# EasyEDA schematic 原理图_转接板1_含压缩推杆控制.json
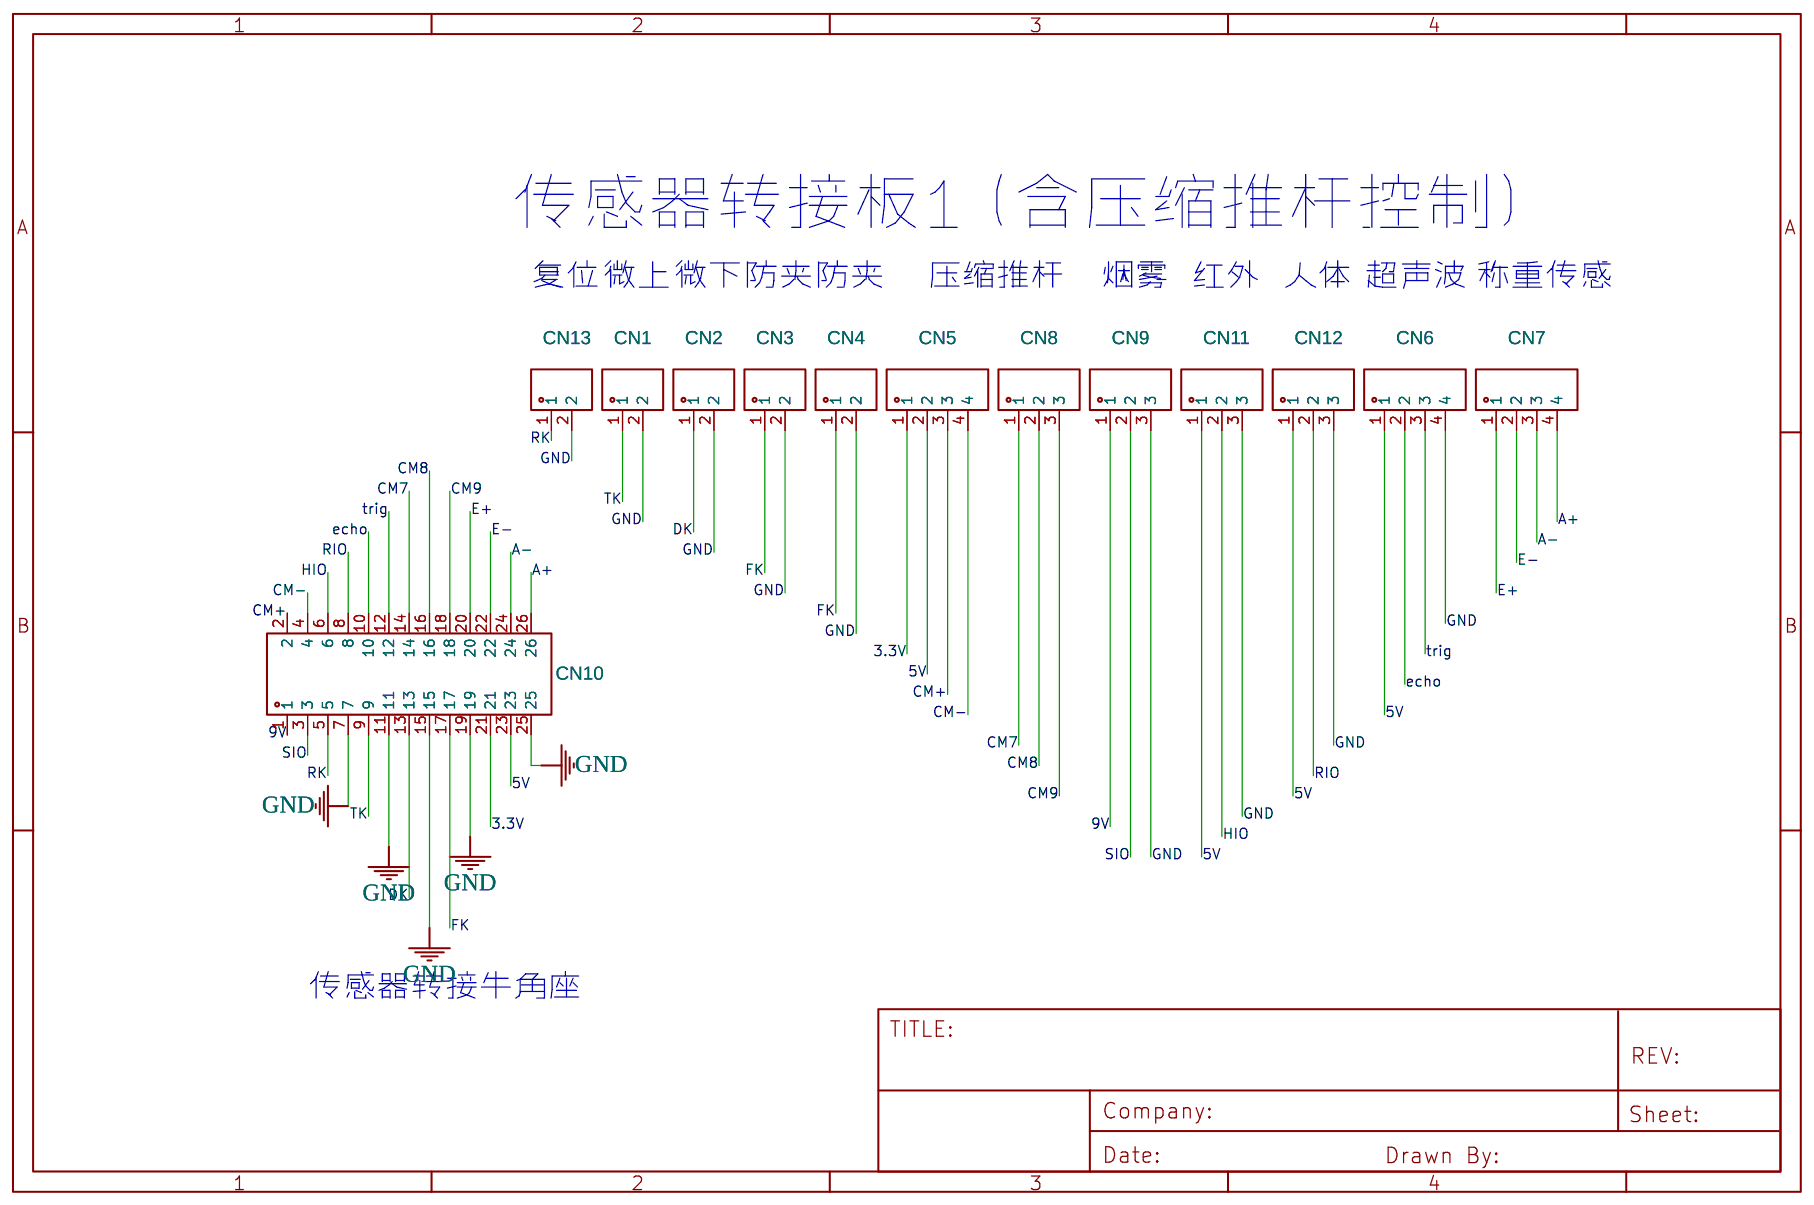
[diagram p0: schematic sheet]

## Parts
CN1  KF2EDGR-2.54-2P  [CONN-TH_P2.54_KF2EDGR-2.54-2P]
CN2  KF2EDGR-2.54-2P  [CONN-TH_P2.54_KF2EDGR-2.54-2P]
CN3  KF2EDGR-2.54-2P  [CONN-TH_P2.54_KF2EDGR-2.54-2P]
CN4  KF2EDGR-2.54-2P  [CONN-TH_P2.54_KF2EDGR-2.54-2P]
CN5  KF2EDGR-2.54-4P  [CONN-TH_4P-P2.54_KF2EDGR-2.54-4P]
CN6  KF2EDGR-2.54-4P  [CONN-TH_4P-P2.54_KF2EDGR-2.54-4P]
CN7  KF2EDGR-2.54-4P  [CONN-TH_4P-P2.54_KF2EDGR-2.54-4P]
CN8  KF2EDGR-2.54-3P  [CONN-TH_3P-P2.54_KF2EDGR-2.54-3P]
CN9  KF2EDGR-2.54-3P  [CONN-TH_3P-P2.54_KF2EDGR-2.54-3P]
CN10  Shenzhen  [CONN-TH_26P-P2.54_B-3000S26P-0110]
CN11  KF2EDGR-2.54-3P  [CONN-TH_3P-P2.54_KF2EDGR-2.54-3P]
CN12  KF2EDGR-2.54-3P  [CONN-TH_3P-P2.54_KF2EDGR-2.54-3P]
CN13  KF2EDGR-2.54-2P  [CONN-TH_P2.54_KF2EDGR-2.54-2P]

## Library data of the parts
CN1-CN4 CN13 = KF2EDGR-2.54-2P: Supplier: LCSC; Supplier Part: C577594; Manufacturer: Cixi Kefa Elec; Contributor: LCSC; JLCPCB SMD: Yes; SMT Type: Extend; Paste Type: expand; Assembly Type: manualWeld
CN5-CN7 = KF2EDGR-2.54-4P: Supplier: LCSC; Supplier Part: C577596; Manufacturer: Cixi Kefa Elec; Contributor: LCSC; JLCPCB SMD: Yes; SMT Type: Extend; Paste Type: expand; Assembly Type: manualWeld
CN8 CN9 CN11 CN12 = KF2EDGR-2.54-3P: Supplier: LCSC; Supplier Part: C577595; Manufacturer: Cixi Kefa Elec; Contributor: LCSC; JLCPCB SMD: Yes; SMT Type: Extend; Paste Type: expand; Assembly Type: manualWeld
CN10 = B-3000S26P-0110: Supplier: LCSC; Supplier Part: C383600; Manufacturer: Shenzhen Cankemeng; Contributor: LCSC

## Nets
3.3V: CN5.1 CN10.21
5V: CN5.2 CN6.1 CN10.23 CN11.1 CN12.1
9V: CN9.1 CN10.1
GND: CN1.2 CN2.2 CN3.2 CN4.2 CN6.4 CN9.3 CN10.7 CN10.11 CN10.15 CN10.19 CN10.25 CN11.3 CN12.3 CN13.2
A+: CN7.4 CN10.26
A-: CN7.3 CN10.24
CM7: CN8.1 CN10.14
CM8: CN8.2 CN10.16
CM9: CN8.3 CN10.18
CM+: CN5.3 CN10.2
CM-: CN5.4 CN10.4
DK: CN2.1 CN10.13
E+: CN7.1 CN10.20
E-: CN7.2 CN10.22
echo: CN6.2 CN10.10
FK: CN3.1 CN4.1 CN10.17
HIO: CN10.6 CN11.2
RIO: CN10.8 CN12.2
RK: CN10.5 CN13.1
SIO: CN9.2 CN10.3
TK: CN1.1 CN10.9
trig: CN6.3 CN10.12

## Notes on the sheet
- 传感器转接板1（含压缩推杆控制）
- 复位
- 微上
- 微下
- 防夹
- 防夹
- 压缩推杆
- 烟雾
- 红外
- 人体
- 超声波
- 称重传感
- 传感器转接牛角座
